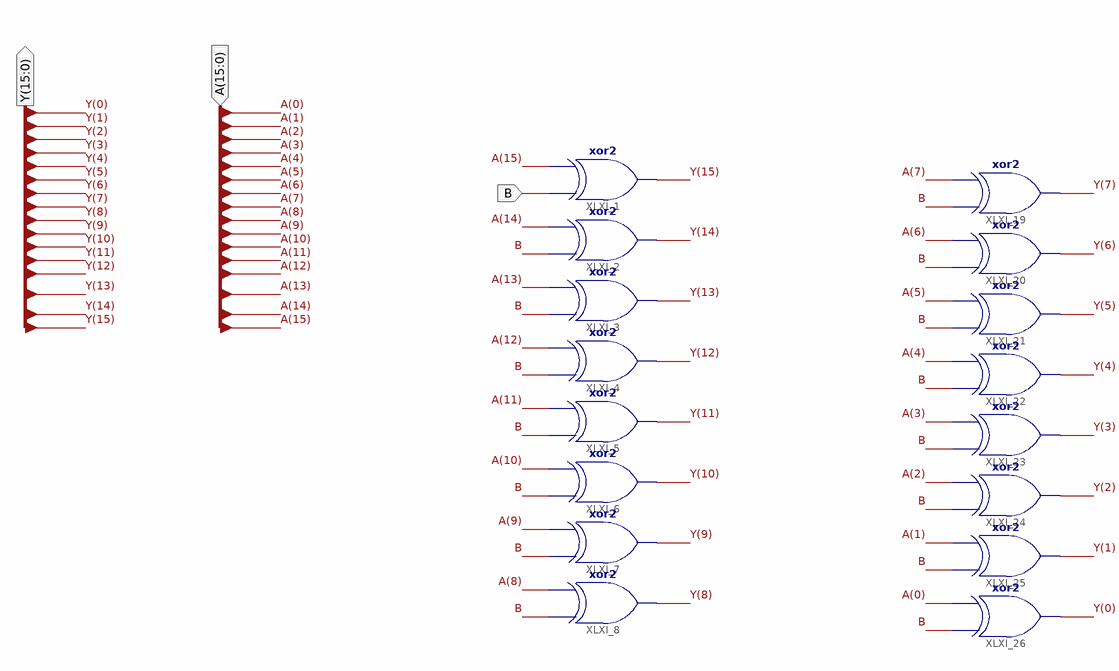
[diagram p0: schematic sheet 1]
// Xilinx ISE schematic XOR16_1.sch (virtex6) as structural Verilog: 16 symbols, 3 ports
module XOR16_1 (
  input  [15:0] A,
  input  B,
  output [15:0] Y
);

  xor XLXI_1 (Y[15], B, A[15]);
  xor XLXI_2 (Y[14], B, A[14]);
  xor XLXI_3 (Y[13], B, A[13]);
  xor XLXI_4 (Y[12], B, A[12]);
  xor XLXI_5 (Y[11], B, A[11]);
  xor XLXI_6 (Y[10], B, A[10]);
  xor XLXI_7 (Y[9], B, A[9]);
  xor XLXI_8 (Y[8], B, A[8]);
  xor XLXI_19 (Y[7], B, A[7]);
  xor XLXI_20 (Y[6], B, A[6]);
  xor XLXI_21 (Y[5], B, A[5]);
  xor XLXI_22 (Y[4], B, A[4]);
  xor XLXI_23 (Y[3], B, A[3]);
  xor XLXI_24 (Y[2], B, A[2]);
  xor XLXI_25 (Y[1], B, A[1]);
  xor XLXI_26 (Y[0], B, A[0]);
endmodule
